# EAGLE design mcu_rev1 (EAGLE 9.5.0)

## Sheet 1 of 2
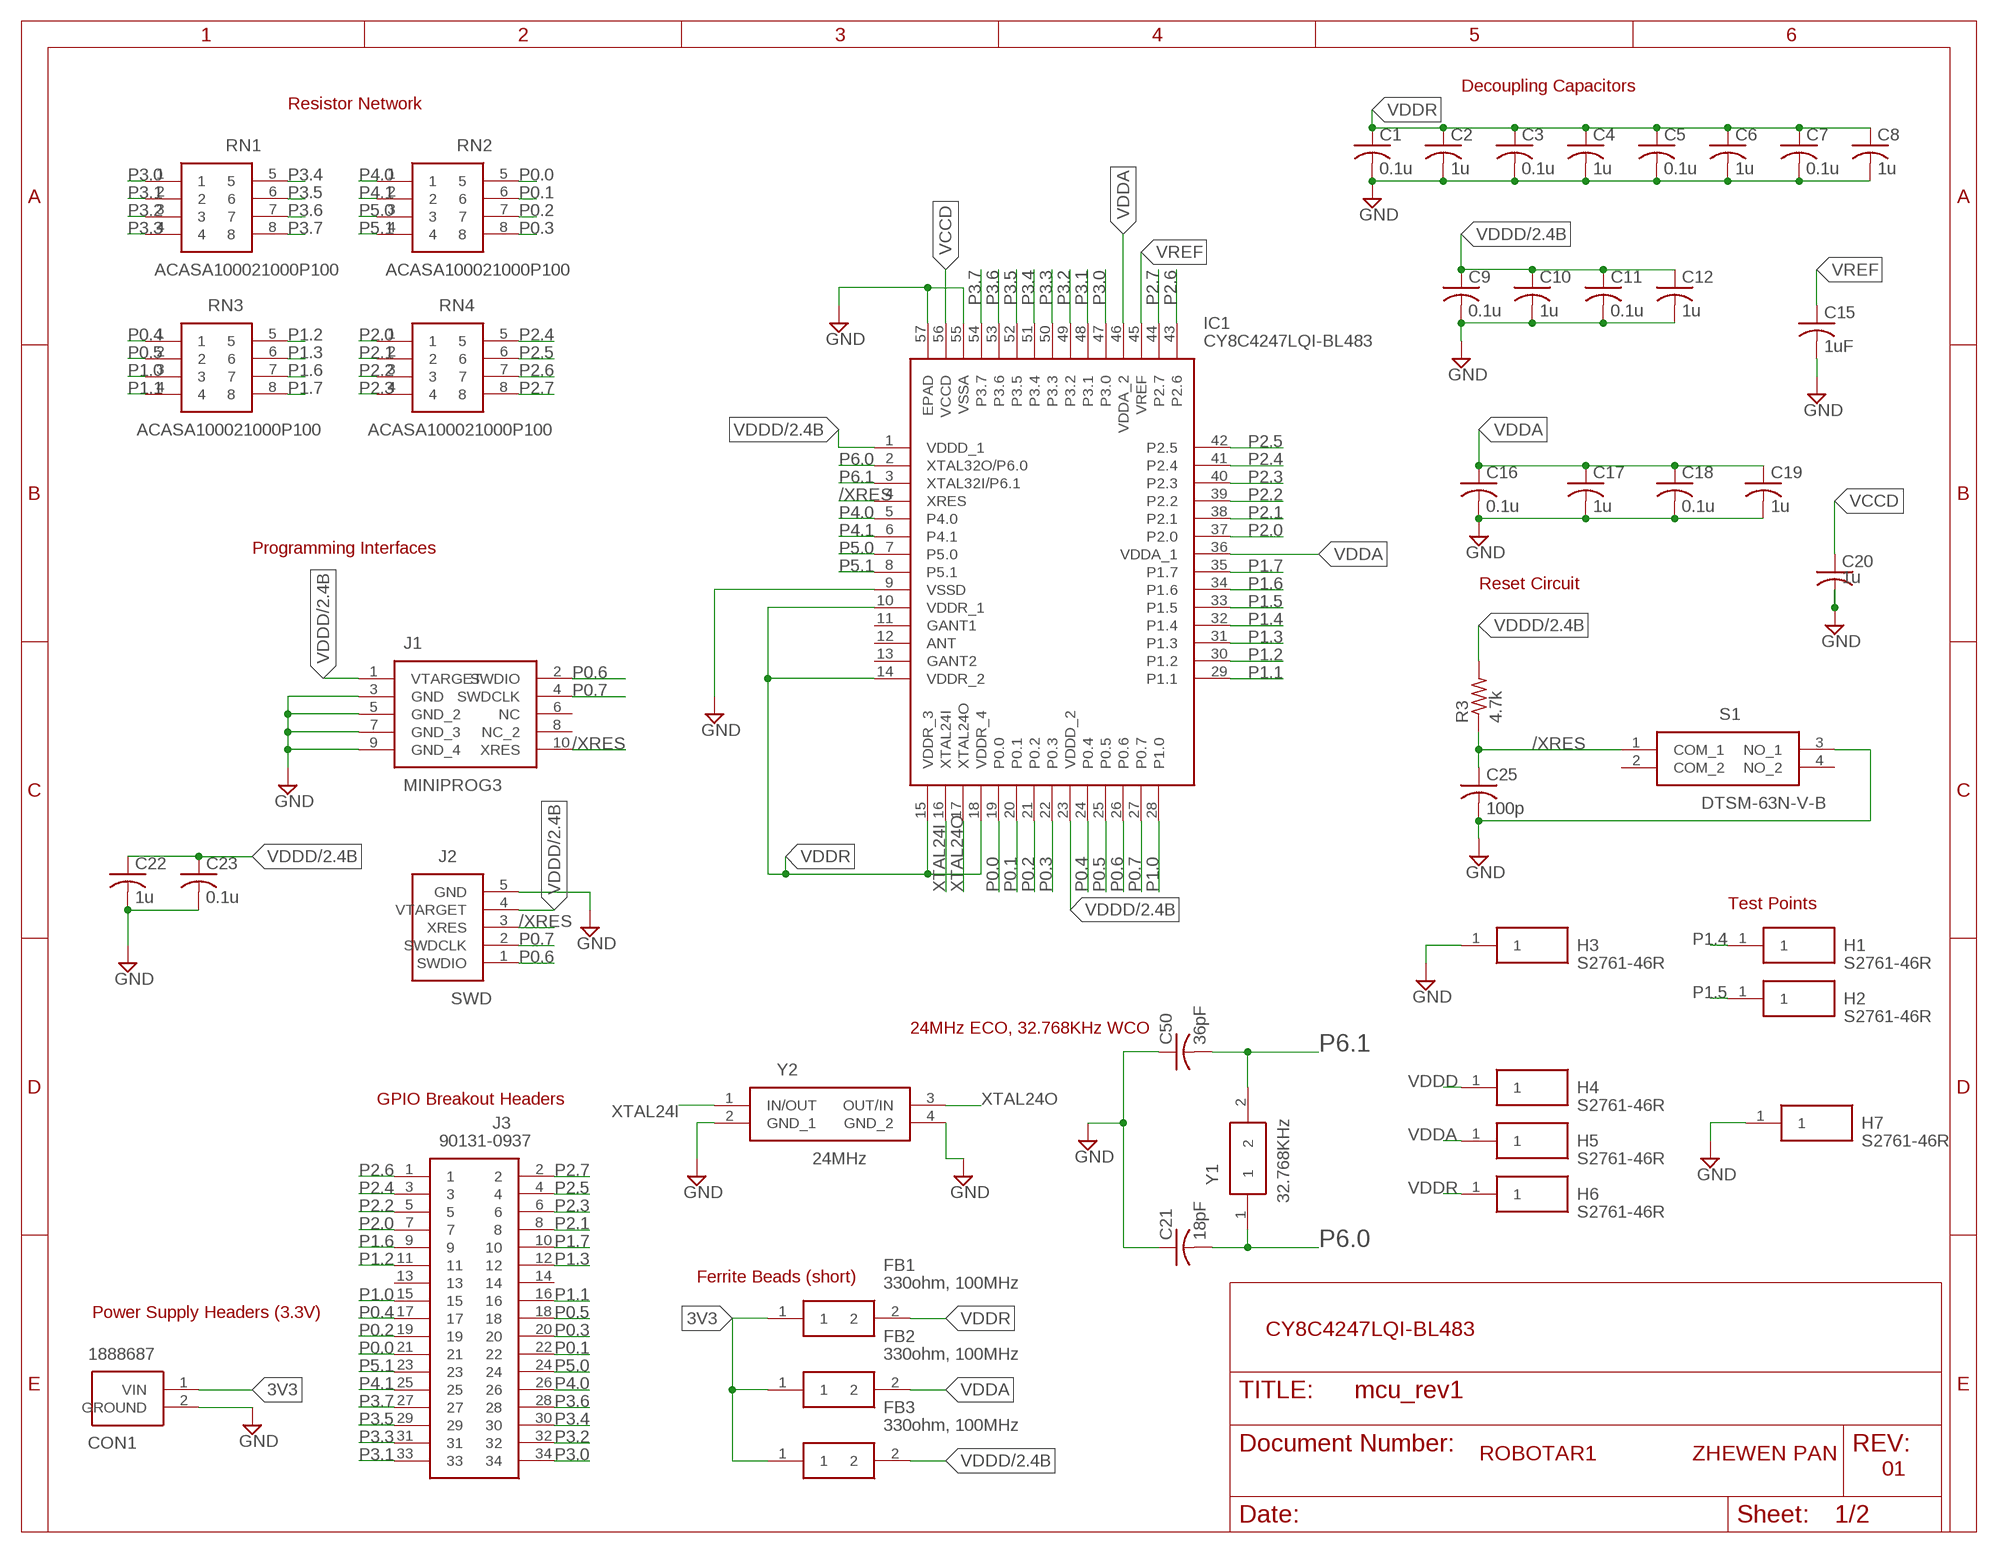
[diagram p0: schematic, sheet 1]

### Parts
C1  0.1u  C-USC0805  [C0805]
C2  1u  C-USC0805  [C0805]
C3  0.1u  C-USC0805  [C0805]
C4  1u  C-USC0805  [C0805]
C5  0.1u  C-USC0805  [C0805]
C6  1u  C-USC0805  [C0805]
C7  0.1u  C-USC0805  [C0805]
C8  1u  C-USC0805  [C0805]
C9  0.1u  C-USC0805  [C0805]
C10  1u  C-USC0805  [C0805]
C11  0.1u  C-USC0805  [C0805]
C12  1u  C-USC0805  [C0805]
C15  1uF  C-USC0805  [C0805]
C16  0.1u  C-USC0805  [C0805]
C17  1u  C-USC0805  [C0805]
C18  0.1u  C-USC0805  [C0805]
C19  1u  C-USC0805  [C0805]
C20  1u  C-USC0805  [C0805]
C21  18pF  C-USC0805  [C0805]
C22  1u  C-USC0805  [C0805]
C23  0.1u  C-USC0805  [C0805]
C25  100p  C-USC0805  [C0805]
C50  36pF  C-USC0805  [C0805]
CON1  1888687  [SHDR2W90P0X508_1X2_1016X950X15]
FB1  330ohm, 100MHz  BLM21PG331SN1D  [BEADC2012X105N]
FB2  330ohm, 100MHz  BLM21PG331SN1D  [BEADC2012X105N]
FB3  330ohm, 100MHz  BLM21PG331SN1D  [BEADC2012X105N]
H1  S2761-46R  [S276146R]
H2  S2761-46R  [S276146R]
H3  S2761-46R  [S276146R]
H4  S2761-46R  [S276146R]
H5  S2761-46R  [S276146R]
H6  S2761-46R  [S276146R]
H7  S2761-46R  [S276146R]
IC1  CY8C4247LQI-BL483  [QFN40P700X700X60-57N]
J1  MINIPROG3  FTSH-105-01-L-DV-K  [FTSH-105-01-L-DV-K]
J2  SWD  22-23-2051  [HDRV5W64P0X254_1X5_1255X635X81]
J3  90131-0937  [HDRV34W90P254_2X17_4308X500X56]
R3  4.7k  R-US_R0805  [R0805]
RN1  ACASA100021000P100  [ACASA100021000P100]
RN2  ACASA100021000P100  [ACASA100021000P100]
RN3  ACASA100021000P100  [ACASA100021000P100]
RN4  ACASA100021000P100  [ACASA100021000P100]
S1  DTSM-63N-V-B  [DTSM63NVB]
Y1  32.768KHz  ECS-.327-12.5-34B-TR  [ECX-31B]
Y2  24MHz  ECS-240-8-36CKM-TR  [ECS240836QAESTR]

### Nets
3V3: CON1.1(VIN) FB1.1 FB2.1 FB3.1
/XRES: C25.1 IC1.4(XRES) J1.10(XRES) J2.3(XRES) R3.1 S1.1(COM_1)
GND: C1.2 C2.2 C3.2 C4.2 C5.2 C6.2 C7.2 C8.2 C9.2 C10.2 C11.2 C12.2 C15.2 C16.2 C17.2 C18.2 C19.2 C20.2 C21.1 C22.2 C23.2 C25.2 C50.1 CON1.2(GROUND) H3.1 H7.1 IC1.9(VSSD) IC1.55(VSSA) IC1.57(EPAD) J1.3(GND) J1.5(GND_2) J1.7(GND_3) J1.9(GND_4) J2.5(GND) S1.3(NO_1) Y2.2(GND_1) Y2.4(GND_2) ; also sheet 2
P0.0: IC1.19(P0.0) J3.21 RN2.5
P0.1: IC1.20(P0.1) J3.22 RN2.6
P0.2: IC1.21(P0.2) J3.19 RN2.7
P0.3: IC1.22(P0.3) J3.20 RN2.8
P0.4: IC1.24(P0.4) J3.17 RN3.1
P0.5: IC1.25(P0.5) J3.18 RN3.2
P0.6: IC1.26(P0.6) J1.2(SWDIO) J2.1(SWDIO)
P0.7: IC1.27(P0.7) J1.4(SWDCLK) J2.2(SWDCLK)
P1.0: IC1.28(P1.0) J3.15 RN3.3
P1.1: IC1.29(P1.1) J3.16 RN3.4
P1.2: IC1.30(P1.2) J3.11 RN3.5
P1.3: IC1.31(P1.3) J3.12 RN3.6
P1.4: H1.1 IC1.32(P1.4) ; also sheet 2
P1.5: H2.1 IC1.33(P1.5) ; also sheet 2
P1.6: IC1.34(P1.6) J3.9 RN3.7 ; also sheet 2
P1.7: IC1.35(P1.7) J3.10 RN3.8
P2.0: IC1.37(P2.0) J3.7 RN4.1
P2.1: IC1.38(P2.1) J3.8 RN4.2
P2.2: IC1.39(P2.2) J3.5 RN4.3
P2.3: IC1.40(P2.3) J3.6 RN4.4
P2.4: IC1.41(P2.4) J3.3 RN4.5
P2.5: IC1.42(P2.5) J3.4 RN4.6
P2.6: IC1.43(P2.6) J3.1 RN4.7
P2.7: IC1.44(P2.7) J3.2 RN4.8
P3.0: IC1.47(P3.0) J3.34 RN1.1
P3.1: IC1.48(P3.1) J3.33 RN1.2
P3.2: IC1.49(P3.2) J3.32 RN1.3
P3.3: IC1.50(P3.3) J3.31 RN1.4
P3.4: IC1.51(P3.4) J3.30 RN1.5
P3.5: IC1.52(P3.5) J3.29 RN1.6
P3.6: IC1.53(P3.6) J3.28 RN1.7
P3.7: IC1.54(P3.7) J3.27 RN1.8
P4.0: IC1.5(P4.0) J3.26 RN2.1
P4.1: IC1.6(P4.1) J3.25 RN2.2
P5.0: IC1.7(P5.0) J3.24 RN2.3
P5.1: IC1.8(P5.1) J3.23 RN2.4
P6.0: C21.2 IC1.2(XTAL32O/P6.0) Y1.1
P6.1: C50.2 IC1.3(XTAL32I/P6.1) Y1.2
VCCD: C20.1 IC1.56(VCCD)
VDDA: C16.1 C17.1 C18.1 C19.1 FB2.2 H5.1 IC1.36(VDDA_1) IC1.46(VDDA_2)
VDDD: C9.1 C10.1 C11.1 C12.1 C22.1 C23.1 FB3.2 H4.1 IC1.1(VDDD_1) IC1.23(VDDD_2) J1.1(VTARGET) J2.4(VTARGET) R3.2 ; also sheet 2
VDDR: C1.1 C2.1 C3.1 C4.1 C5.1 C6.1 C7.1 C8.1 FB1.2 H6.1 IC1.10(VDDR_1) IC1.14(VDDR_2) IC1.15(VDDR_3) IC1.18(VDDR_4)
VREF: C15.1 IC1.45(VREF)
XTAL24I: IC1.16(XTAL24I) Y2.1(IN/OUT)
XTAL24O: IC1.17(XTAL24O) Y2.3(OUT/IN)
Unconnected: IC1.11(GANT1) IC1.12(ANT) IC1.13(GANT2) J1.6(NC) J1.8(NC_2) J3.13 J3.14 S1.2(COM_2) S1.4(NO_2)

### Notes on the sheet
- Decoupling Capacitors
- Resistor Network
- Programming Interfaces
- Reset Circuit
- Test Points
- 24MHz ECO, 32.768KHz WCO
- GPIO Breakout Headers
- Ferrite Beads (short)
- Power Supply Headers (3.3V)
- CY8C4247LQI-BL483
- ROBOTAR1 | ZHEWEN PAN | 01

## Sheet 2 of 2
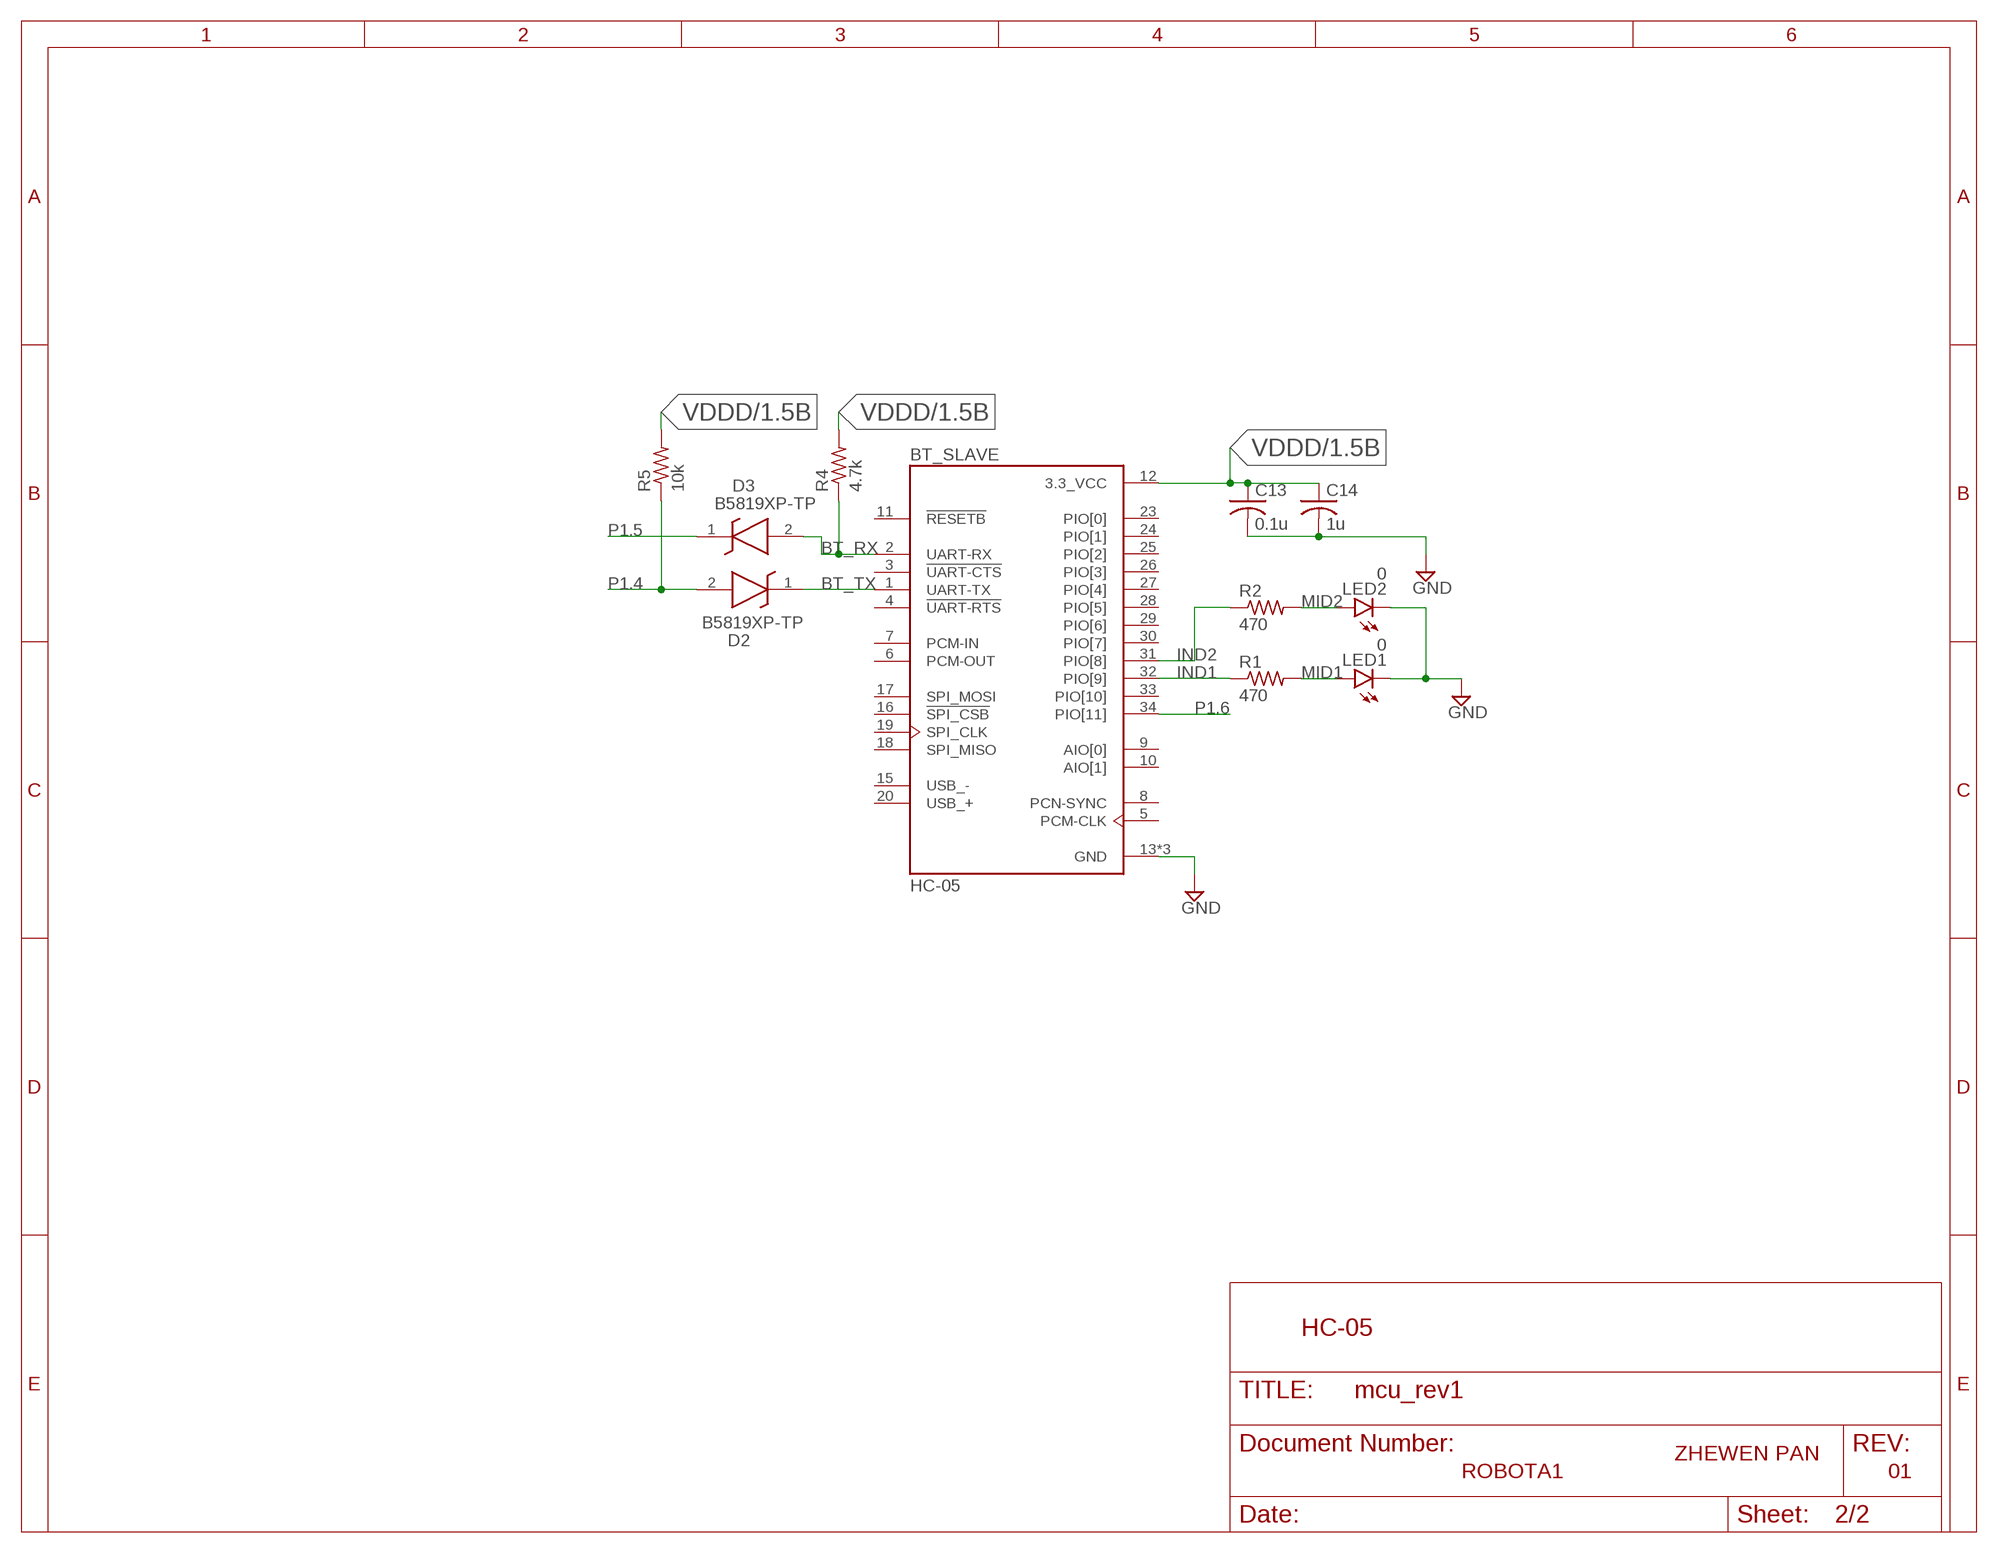
[diagram p1: schematic, sheet 2]

### Parts
BT_SLAVE  HC-05  [XCVR_HC-05]
C13  0.1u  C-USC0805  [C0805]
C14  1u  C-USC0805  [C0805]
D2  B5819XP-TP  [B5819XPTP]
D3  B5819XP-TP  [B5819XPTP]
LED1  0  LEDSML0805  [SML0805]
LED2  0  LEDSML0805  [SML0805]
R1  470  R-US_R0805  [R0805]
R2  470  R-US_R0805  [R0805]
R4  4.7k  R-US_R0805  [R0805]
R5  10k  R-US_R0805  [R0805]

### Nets
BT_RX: BT_SLAVE.2(UART-RX) D3.2(+) R4.1
BT_TX: BT_SLAVE.1(UART-TX) D2.1(-)
GND: BT_SLAVE.13(GND) BT_SLAVE.21(GND) BT_SLAVE.22(GND) C13.2 C14.2 LED1.C LED2.C ; also sheet 1
IND1: BT_SLAVE.32(PIO[9]) R1.1
IND2: BT_SLAVE.31(PIO[8]) R2.1
MID1: LED1.A R1.2
MID2: LED2.A R2.2
P1.4: D2.2(+) R5.1 ; also sheet 1
P1.5: D3.1(-) ; also sheet 1
P1.6: BT_SLAVE.34(PIO[11]) ; also sheet 1
VDDD: BT_SLAVE.12(3.3_VCC) C13.1 C14.1 R4.2 R5.2 ; also sheet 1
Unconnected: BT_SLAVE.3(!UART-CTS) BT_SLAVE.4(!UART-RTS) BT_SLAVE.5(PCM-CLK) BT_SLAVE.6(PCM-OUT) BT_SLAVE.7(PCM-IN) BT_SLAVE.8(PCN-SYNC) BT_SLAVE.9(AIO[0]) BT_SLAVE.10(AIO[1]) BT_SLAVE.11(!RESETB) BT_SLAVE.15(USB_-) BT_SLAVE.16(!SPI_CSB) BT_SLAVE.17(SPI_MOSI) BT_SLAVE.18(SPI_MISO) BT_SLAVE.19(SPI_CLK) BT_SLAVE.20(USB_+) BT_SLAVE.23(PIO[0]) BT_SLAVE.24(PIO[1]) BT_SLAVE.25(PIO[2]) BT_SLAVE.26(PIO[3]) BT_SLAVE.27(PIO[4]) BT_SLAVE.28(PIO[5]) BT_SLAVE.29(PIO[6]) BT_SLAVE.30(PIO[7]) BT_SLAVE.33(PIO[10])

### Notes on the sheet
- HC-05
- ZHEWEN PAN
- ROBOTA1 | 01

## Library data of the parts
BT_SLAVE = HC-05:HC-05: Bluetooth to Serial Port Module; AVAILABILITY: Unavailable; MF: Texas Instruments; MP: HC-05; PACKAGE: SOIC-14; PRICE: None; SPICEPREFIX: X
C1-C23 C25 C50 = rcl:C-US: CAPACITOR, American symbol; SPICEPREFIX: C
CON1 = SamacSys_Parts:1888687: Phoenix Contact COMBICON MKDSN Series 5.08mm Pitch Straight PCB Terminal Block with Screw Termination, Through Hole Source: Datasheet <http://uk.rs-online.com/web/p/products/8045095>; ALLIED_NUMBER: 70054422; DESCRIPTION: Phoenix Contact COMBICON MKDSN Series 5.08mm Pitch Straight PCB Terminal Block with Screw Termination, Through Hole; HEIGHT: 15mm; MANUFACTURER_NAME: Phoenix Contact; MANUFACTURER_PART_NUMBER: 1888687; RS_PART_NUMBER: 8045095; RS_PRICE-STOCK: http://uk.rs-online.com/web/p/products/8045095
D2 D3 = SamacSys_Parts:B5819XP-TP: Schottky Diodes & Rectifiers 1A,40V,Schottky,FBP-02L Package Source: Datasheet <http://www.mccsemi.com/up_pdf/B5819XP(FBP-02L)-B.pdf>; DESCRIPTION: Schottky Diodes & Rectifiers 1A,40V,Schottky,FBP-02L Package; HEIGHT: 0.55mm; MANUFACTURER_NAME: Micro Commercial Components (MCC); MANUFACTURER_PART_NUMBER: B5819XP-TP
FB1-FB3 = BLM21PG331SN1D:BLM21PG331SN1D: Ferrite bead 0805 SMD 330R 1.5A Ferrite bead 0805 SMD 330R 1.5A Source: Datasheet <http://uk.rs-online.com/web/p/products/7241545P>; DESCRIPTION: Ferrite bead 0805 SMD 330R 1.5A Ferrite bead 0805 SMD 330R 1.5A; HEIGHT: 1.05mm; MANUFACTURER_NAME: Murata Electronics; MANUFACTURER_PART_NUMBER: BLM21PG331SN1D; RS_PART_NUMBER: 7241545P; RS_PRICE-STOCK: http://uk.rs-online.com/web/p/products/7241545P
H1-H7 = S2761-46R:S2761-46R: Circuit Board Hardware - PCB SMT Mini Test Terminal, Reel Source: Datasheet <https://cdn.harwin.com/pdfs/S2761R.pdf>; DESCRIPTION: Circuit Board Hardware - PCB SMT Mini Test Terminal, Reel; HEIGHT: 1.15mm; MANUFACTURER_NAME: HARWIN; MANUFACTURER_PART_NUMBER: S2761-46R
IC1 = cy_mcu:CY8C4247LQI-BL483: CYPRESS SEMICONDUCTOR - CY8C4247LQI-BL483 - MCU, 32BIT, CORTEX-M0, 48MHZ, QFN-56 Source: Datasheet <http://uk.rs-online.com/web/p/products/1242964P>; DESCRIPTION: CYPRESS SEMICONDUCTOR - CY8C4247LQI-BL483 - MCU, 32BIT, CORTEX-M0, 48MHZ, QFN-56; HEIGHT: 0.6mm; MANUFACTURER_NAME: Cypress Semiconductor; MANUFACTURER_PART_NUMBER: CY8C4247LQI-BL483; RS_PART_NUMBER: 1242964P; RS_PRICE-STOCK: http://uk.rs-online.com/web/p/products/1242964P
J1 = SamacSys_Parts:FTSH-105-01-L-DV-K: SMT Micro Header, 10 position, 2-row Source: Datasheet <http://suddendocs.samtec.com/catalog_english/ftsh_smt.pdf>; DESCRIPTION: SMT Micro Header, 10 position, 2-row; HEIGHT: mm; MANUFACTURER_NAME: SAMTEC; MANUFACTURER_PART_NUMBER: FTSH-105-01-L-DV-K; RS_PART_NUMBER: 1592332; RS_PRICE-STOCK: https://uk.rs-online.com/web/p/products/1592332
J2 = SamacSys_Parts:22-23-2051: Headers & Wire Housings VERT PCB HDR 5P TIN FRICTION LOCK Source: Datasheet <http://uk.rs-online.com/web/p/products/1888757>; ALLIED_NUMBER: 70190811; DESCRIPTION: Headers & Wire Housings VERT PCB HDR 5P TIN FRICTION LOCK; HEIGHT: 8.18mm; MANUFACTURER_NAME: Molex; MANUFACTURER_PART_NUMBER: 22-23-2051; RS_PART_NUMBER: 1888757; RS_PRICE-STOCK: http://uk.rs-online.com/web/p/products/1888757
J3 = 90131-0937:90131-0937: Molex C-GRID III Series, Series Number 90131, 2.54mm Pitch 34 Way 2 Row Straight PCB Header, Solder Termination, 3A Source: Datasheet <http://uk.rs-online.com/web/p/products/6703569>; ALLIED_NUMBER: 70373750; DESCRIPTION: Molex C-GRID III Series, Series Number 90131, 2.54mm Pitch 34 Way 2 Row Straight PCB Header, Solder Termination, 3A; HEIGHT: 5.6mm; MANUFACTURER_NAME: Molex; MANUFACTURER_PART_NUMBER: 90131-0937; RS_PART_NUMBER: 6703569; RS_PRICE-STOCK: http://uk.rs-online.com/web/p/products/6703569
LED1 LED2 = led:LED: LED OSRAM: - CHIPLED LG R971, LG N971, LY N971, LG Q971, LY Q971, LO R971, LY R971 LH N974, LH R974 LS Q976, LO Q976, LY Q976 LO Q996 - Hyper CHIPLED LW Q18S LB Q993, LB Q99A, LB R99A - SideLED LS A670, LO A670, LY A670, LG A670, LP A670 LB A673, LV A673, LT A673, LW A673 LH A674 LY A675 LS A676, LA A676, LO A676, LY A676, LW A676 LS A679, LY A679, LG A679 - Hyper Micro SIDELED® LS Y876, LA Y876, LO Y876, LY Y876 LT Y87S - SmartLED LW L88C, LW L88S LB L89C, LB L89S, LG L890 LS L89K, LO L89K, LY L89K LS L896, LA L896, LO L896, LY L896 - TOPLED LS T670, LO T670, LY T670, LG T670, LP T670 LSG T670, LSP T670, LSY T670, LOP T670, LYG T670 LG T671, LOG T671, LSG T671 LB T673, LV T673, LT T673, LW T673 LH T674 LS T676, LA T676, LO T676, LY T676, LB T676, LH T676, LSB T676, LW T676 LB T67C, LV T67C, LT T67C, LS T67K, LO T67K, LY T67K, LW E67C LS E67B, LA E67B, LO E67B, LY E67B, LB E67C, LV E67C, LT E67C LW T67C LS T679, LY T679, LG T679 LS T770, LO T770, LY T770, LG T770, LP T770 LB T773, LV T773, LT T773, LW T773 LH T774 LS E675, LA E675, LY E675, LS T675 LS T776, LA T776, LO T776, LY T776, LB T776 LHGB T686 LT T68C, LB T68C - Hyper Mini TOPLED® LB M676 - Mini TOPLED Santana® LG M470 LS M47K, LO M47K, LY M47K Source: http://www.osram.convergy.de LUXEON: - LUMILED® LXK2-PW12-R00, LXK2-PW12-S00, LXK2-PW14-U00, LXK2-PW14-V00 LXK2-PM12-R00, LXK2-PM12-S00, LXK2-PM14-U00 LXK2-PE12-Q00, LXK2-PE12-R00, LXK2-PE12-S00, LXK2-PE14-T00, LXK2-PE14-U00 LXK2-PB12-K00, LXK2-PB12-L00, LXK2-PB12-M00, LXK2-PB14-N00, LXK2-PB14-P00, LXK2-PB14-Q00 LXK2-PR12-L00, LXK2-PR12-M00, LXK2-PR14-Q00, LXK2-PR14-R00 LXK2-PD12-Q00, LXK2-PD12-R00, LXK2-PD12-S00 LXK2-PH12-R00, LXK2-PH12-S00 LXK2-PL12-P00, LXK2-PL12-Q00, LXK2-PL12-R00 Source: www.luxeon.com KINGBRIGHT: KA-3528ASYC Source: www.kingbright.com
R1-R5 = rcl:R-US_: RESISTOR, American symbol; SPICEPREFIX: R
RN1-RN4 = ACASA100021000P100:ACASA100021000P100: Vishay ACAS 0612 - Professional Series 100 +/-0.5% Isolated SMT Resistor Array, 4 Resistors, 0.3W total Source: Datasheet <http://uk.rs-online.com/web/p/products/6845742P>; ALLIED_NUMBER: 70398241; DESCRIPTION: Vishay ACAS 0612 - Professional Series 100 +/-0.5% Isolated SMT Resistor Array, 4 Resistors, 0.3W total; HEIGHT: 0mm; MANUFACTURER_NAME: Vishay; MANUFACTURER_PART_NUMBER: ACASA100021000P100; RS_PART_NUMBER: 6845742P; RS_PRICE-STOCK: http://uk.rs-online.com/web/p/products/6845742P
S1 = push_button:DTSM-63N-V-B: Tactile Switches Surface Mounting Type 6*6 Source: Datasheet <http://www.dip.com.tw/en/en-product-information/en-switch004/item/download/2502_92b64433b455dc19d9198989b26071be>; DESCRIPTION: Tactile Switches Surface Mounting Type 6*6; HEIGHT: 7.1mm; MANUFACTURER_NAME: Diptronics; MANUFACTURER_PART_NUMBER: DTSM-63N-V-B
Y1 = SamacSys_Parts:ECS-.327-12.5-34B-TR: Crystals 32.768KHz 20ppm 12.5pF -40C +85C Source: Datasheet; DESCRIPTION: Crystals 32.768KHz 20ppm 12.5pF -40C +85C; HEIGHT: mm; MANUFACTURER_NAME: ECS; MANUFACTURER_PART_NUMBER: ECS-.327-12.5-34B-TR
Y2 = SamacSys_Parts:ECS-240-8-36CKM-TR: Crystals 24MHz 10ppm Source: Datasheet; DESCRIPTION: Crystals 24MHz 10ppm; HEIGHT: 0mm; MANUFACTURER_NAME: ECS; MANUFACTURER_PART_NUMBER: ECS-240-8-36CKM-TR; SPICEPREFIX: E

## Board
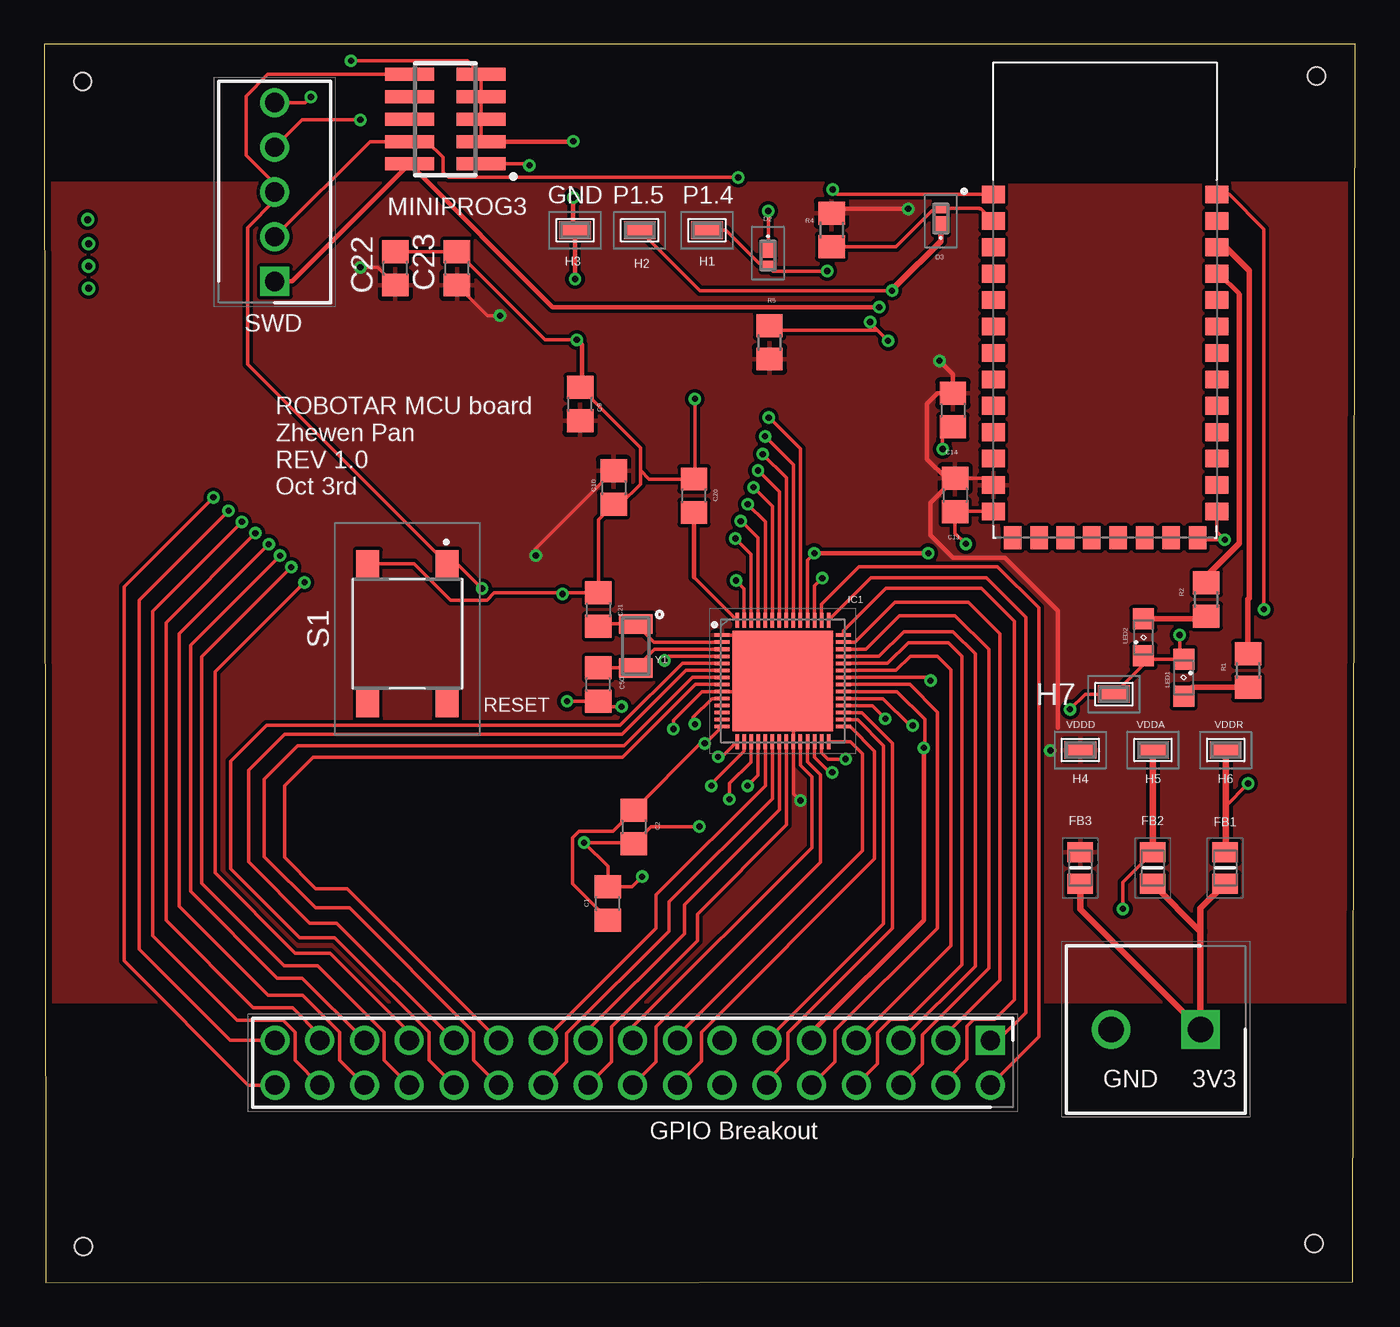
[diagram p2: board, top side]
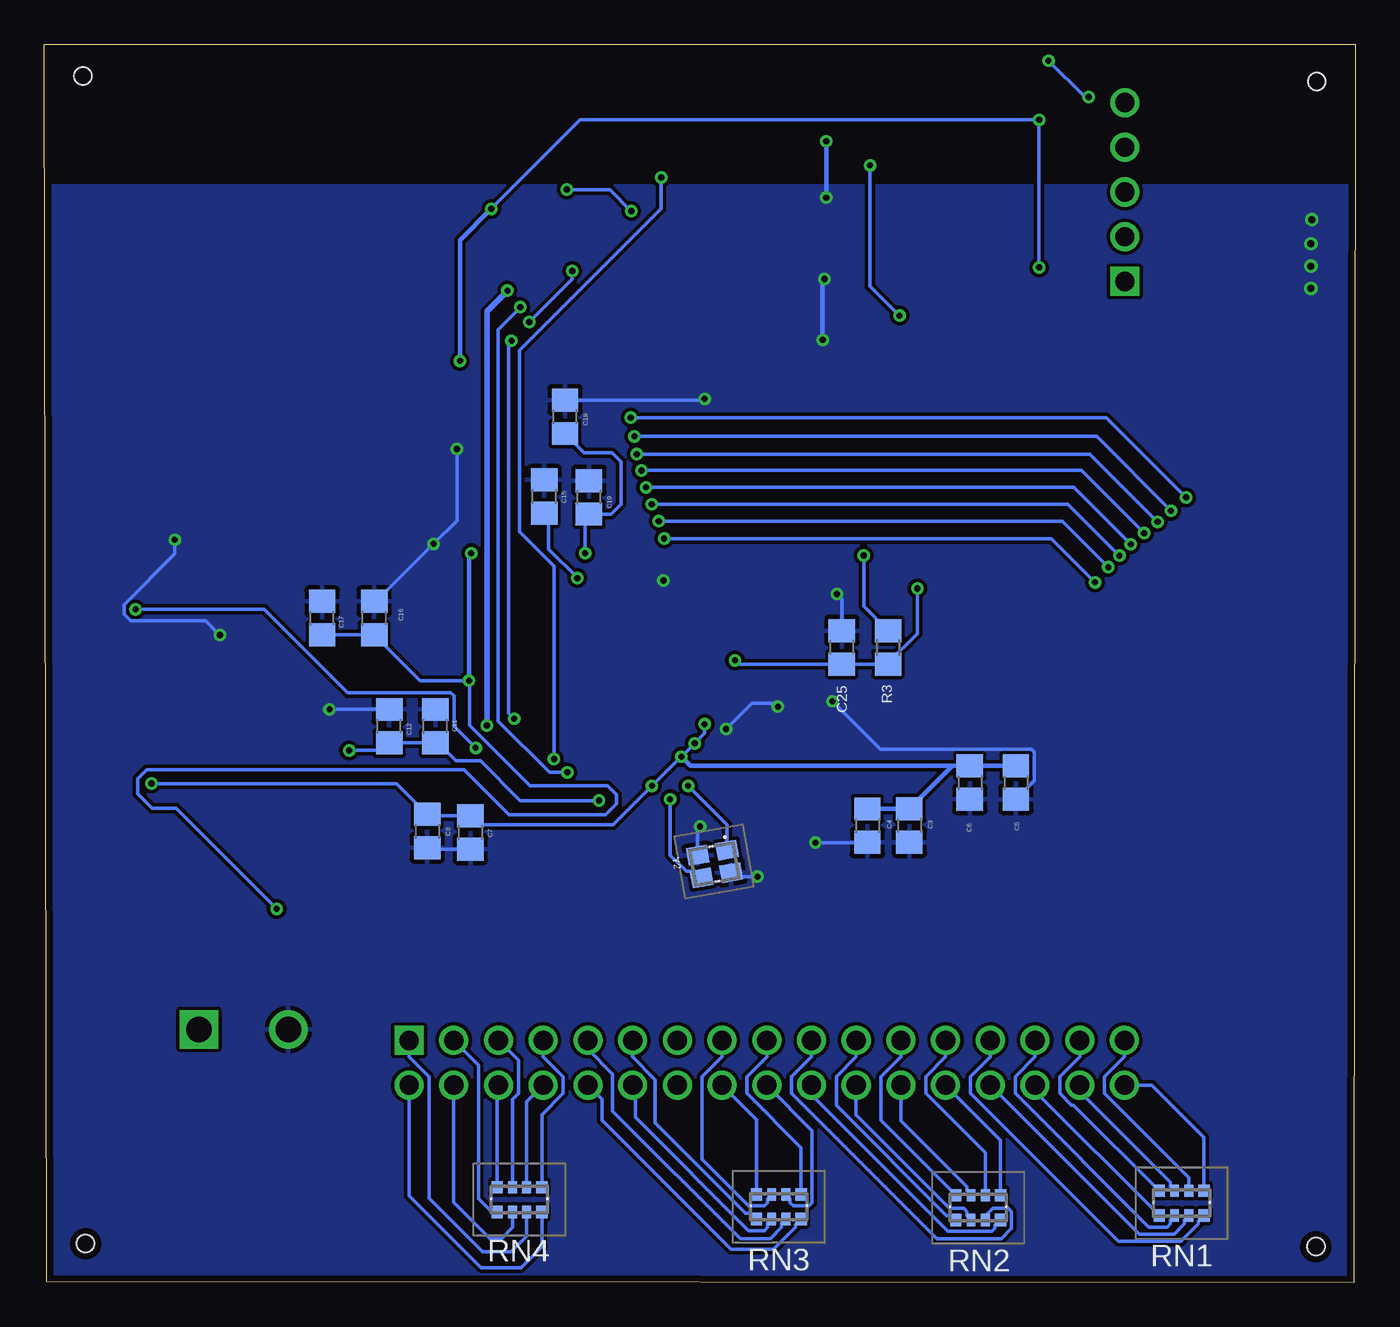
[diagram p3: board, bottom side, seen from below]

Size 74.5 x 70.34 mm. Coordinates in mm from the lower left corner, seen from the top.
Outline: 0.1,0 74.35,0.05 74.5,70.34 0,70.34 0.1,0
Copper layers (1*16): Top 0.0356mm / dielectric 1.5011mm / Bottom 0.0356mm
Design rules "ECE_Senior_Design": minimum track width 8mil, minimum drill 13mil, track to track 8mil, track to pad 8mil, pad to pad 6mil, via to via 8mil, smd to smd 6mil, copper to edge 15mil, drill to drill 8mil, minimum pad ring 7mil, minimum via ring 7mil, stop-mask expansion 3mil, vias tented up to drill 0mil, thermal gap 10mil
Holes 1 mm at 2.2,68.22 72.29,68.52 72.14,2.23 2.24,2.06

### Footprints (pad centres in the part's own frame; a part is rotated, then mirrored left to right if it is on the bottom)
XCVR_HC-05 = smd 1.3 x 1: 1 -6.35,6.325; 2 -6.35,4.825; 3 -6.35,3.325; 4 -6.35,1.825; 5 -6.35,0.325; 6 -6.35,-1.175; 7 -6.35,-2.675; 8 -6.35,-4.175; 9 -6.35,-5.675; 10 -6.35,-7.175; 11 -6.35,-8.675; 12 -6.35,-10.175; 13 -6.35,-11.675; 22 6.35,-11.675; 23 6.35,-10.175; 24 6.35,-8.675; 25 6.35,-7.175; 26 6.35,-5.675; 27 6.35,-4.175; 28 6.35,-2.675; 29 6.35,-1.175; 30 6.35,0.325; 31 6.35,1.825; 32 6.35,3.325; 33 6.35,4.825; 34 6.35,6.325 | smd 1 x 1.3: 14 -5.25,-13.175; 15 -3.75,-13.175; 16 -2.25,-13.175; 17 -0.75,-13.175; 18 0.75,-13.175; 19 2.25,-13.175; 20 3.75,-13.175; 21 5.25,-13.175
C0805 = smd 1.3 x 1.5: 1 -0.95,0; 2 0.95,0
SHDR2W90P0X508_1X2_1016X950X15 = drill 1.45 pad 2.175 square: 1 0,0 | drill 1.45 pad 2.175: 2 5.08,0
B5819XPTP = smd 1 x 0.76: 1 -0.365,0 | smd 0.56 x 0.7: 2 0.585,0
BEADC2012X105N = smd 1.15 x 1.45: 1 -0.9,0; 2 0.9,0
S276146R = smd 1.8 x 1: 1 0,0
QFN40P700X700X60-57N = smd 0.85 x 0.2: 1 -3.45,2.6; 2 -3.45,2.2; 3 -3.45,1.8; 4 -3.45,1.4; 5 -3.45,1; 6 -3.45,0.6; 7 -3.45,0.2; 8 -3.45,-0.2; 9 -3.45,-0.6; 10 -3.45,-1; 11 -3.45,-1.4; 12 -3.45,-1.8; 13 -3.45,-2.2; 14 -3.45,-2.6; 29 3.45,-2.6; 30 3.45,-2.2; 31 3.45,-1.8; 32 3.45,-1.4; 33 3.45,-1; 34 3.45,-0.6; 35 3.45,-0.2; 36 3.45,0.2; 37 3.45,0.6; 38 3.45,1; 39 3.45,1.4; 40 3.45,1.8; 41 3.45,2.2; 42 3.45,2.6 | smd 0.2 x 0.85: 15 -2.6,-3.45; 16 -2.2,-3.45; 17 -1.8,-3.45; 18 -1.4,-3.45; 19 -1,-3.45; 20 -0.6,-3.45; 21 -0.2,-3.45; 22 0.2,-3.45; 23 0.6,-3.45; 24 1,-3.45; 25 1.4,-3.45; 26 1.8,-3.45; 27 2.2,-3.45; 28 2.6,-3.45; 43 2.6,3.45; 44 2.2,3.45; 45 1.8,3.45; 46 1.4,3.45; 47 1,3.45; 48 0.6,3.45; 49 0.2,3.45; 50 -0.2,3.45; 51 -0.6,3.45; 52 -1,3.45; 53 -1.4,3.45; 54 -1.8,3.45; 55 -2.2,3.45; 56 -2.6,3.45 | smd 5.7 x 5.7: 57 0,0
FTSH-105-01-L-DV-K = smd 0.74 x 2.79: 1 -2.54,-2.035; 2 -2.54,2.035; 3 -1.27,-2.035; 4 -1.27,2.035; 5 0,-2.035; 6 0,2.035; 7 1.27,-2.035; 8 1.27,2.035; 9 2.54,-2.035; 10 2.54,2.035
HDRV5W64P0X254_1X5_1255X635X81 = drill 1.1 pad 1.65 square: 1 0,0 | drill 1.1 pad 1.65: 2 2.54,0; 3 5.08,0; 4 7.62,0; 5 10.16,0
HDRV34W90P254_2X17_4308X500X56 = drill 1.1 pad 1.65 square: 1 0,0 | drill 1.1 pad 1.65: 2 0,2.54; 3 2.54,0; 4 2.54,2.54; 5 5.08,0; 6 5.08,2.54; 7 7.62,0; 8 7.62,2.54; 9 10.16,0; 10 10.16,2.54; 11 12.7,0; 12 12.7,2.54; 13 15.24,0; 14 15.24,2.54; 15 17.78,0; 16 17.78,2.54; 17 20.32,0; 18 20.32,2.54; 19 22.86,0; 20 22.86,2.54; 21 25.4,0; 22 25.4,2.54; 23 27.94,0; 24 27.94,2.54; 25 30.48,0; 26 30.48,2.54; 27 33.02,0; 28 33.02,2.54; 29 35.56,0; 30 35.56,2.54; 31 38.1,0; 32 38.1,2.54; 33 40.64,0; 34 40.64,2.54
SML0805 = smd 1.2 x 1.2: A 1.05,0; C -1.05,0
R0805 = smd 1.3 x 1.5: 1 -0.95,0; 2 0.95,0
ACASA100021000P100 = smd 0.64 x 0.7: 1 -1.27,-0.7; 4 1.27,-0.7; 5 1.27,0.7; 8 -1.27,0.7 | smd 0.5 x 0.7: 2 -0.4,-0.7; 3 0.4,-0.7; 6 0.4,0.7; 7 -0.4,0.7
DTSM63NVB = smd 1.55 x 1.3: 1 -3.975,2.25; 2 3.975,2.25; 3 -3.975,-2.25; 4 3.975,-2.25
ECX-31B = smd 1.1 x 1.9: 1 -1.25,0; 2 1.25,0
ECS240836QAESTR = smd 1.2 x 1: 1 -0.85,-0.65; 2 0.85,-0.65; 3 0.85,0.65; 4 -0.85,0.65

### Placement (x,y rotation side)
BT_SLAVE  60.27,55.47 0 top
C1  32.03,21.53 90 top
C2  33.51,25.89 270 top
C3  25.35,25.97 270 bottom
C4  27.72,25.95 270 bottom
C5  19.29,28.4 270 bottom
C6  21.91,28.4 270 bottom
C7  50.28,25.57 270 bottom
C8  52.73,25.65 270 bottom
C9  30.45,49.89 90 top
C10  32.36,45.15 270 top
C11  52.27,31.61 90 bottom
C12  54.89,31.61 90 bottom
C13  51.76,44.73 270 top
C14  51.63,49.56 270 top
C15  46.09,44.65 90 bottom
C16  55.74,37.74 90 bottom
C17  58.7,37.74 90 bottom
C18  44.9,49.17 90 bottom
C19  43.55,44.6 90 bottom
C20  36.92,44.69 90 top
C21  31.49,38.23 270 top
C22  19.96,57.61 90 top
C23  23.46,57.61 90 top
C25  29.18,36.08 90 bottom
C50  31.49,33.97 90 top
CON1  65.7,14.39 180 top
D2  41.12,58.33 270 top
D3  50.94,60.43 90 top
FB1  67.09,23.55 90 top
FB2  62.98,23.55 90 top
FB3  58.87,23.55 90 top
H1  37.66,59.77 0 top
H2  33.84,59.77 0 top
H3  30.17,59.77 0 top
H4  58.87,30.25 0 top
H5  63,30.25 0 top
H6  67.12,30.25 0 top
H7  60.77,33.43 0 top
IC1  41.97,34.17 0 top
J1  22.79,66.08 90 top
J2  13.11,56.86 90 top
J3  53.76,13.76 180 top
LED1  64.74,34.36 270 top
LED2  62.45,36.65 90 top
R1  68.39,34.76 270 top
R2  66.02,38.8 270 top
R3  26.55,36.08 90 bottom
R4  44.74,59.79 90 top
R5  41.21,53.41 270 top
RN1  9.87,4.52 180 bottom
RN2  21.43,4.27 180 bottom
RN3  32.76,4.32 180 bottom
RN4  47.49,4.72 180 bottom
S1  20.64,36.86 270 top
Y1  33.63,36.16 270 top
Y2  36.42,23.78 190 bottom

### Tracks (layer width: path | path; a pad name or v marks a point on that pad's centre or on a via)
3V3
  Top 0.381: CON1.1 65.7,21.26 FB1.1 | CON1.1 65.7,19.94 FB2.1 | CON1.1 58.87,21.22 FB3.1
/XRES  (via drill 0.35)
  Top 0.203: J1.10 12.72,68.62 11.49,67.39 11.49,64.03 13.11,62.42 J2.3 13.11,61.46 11.57,59.92 11.57,52.15 S1.1 23.47,40.83 v24.88,39.42 | IC1.4 35.48,35.57 v35.25,35.34
  Bottom 0.203: v35.25,35.34 35.04,35.13 C25.1 R3.1 26.55,35.2 24.89,36.87 v24.89,39.42 v24.88,39.42
BT_RX
  Top 0.203: BT_SLAVE.2 53.22,60.99 53.14,60.99 53.12,61.02 D3.2 50.8,60.87 50.43,60.87 48.4,58.84 R4.1
BT_TX  (via drill 0.35)
  Top 0.203: BT_SLAVE.1 45.08,61.8 v44.8,62.08 | v41.14,60.86 41.14,58.71 D2.1
  Bottom 0.203: v44.8,62.08 42.36,62.08 v41.14,60.86
GND  (via drill 0.35, 0.4)
  Top 0.203: J1.3 J1.5 J1.7 J1.9 24.05,69.39 v17.44,69.39 | 33.87,46.13 33.87,45.35 32.73,44.2 C10.2 31.49,43.33 C21.1 29.52,39.18 | 33.87,46.13 33.87,47.42 30.56,50.74 C9.2 | 30.17,59.87 H3.1 | v15.16,67.34 14.84,67.02 J2.5 | 29.52,39.18 v29.46,39.12 | v52.37,41.96 51.76,42.57 C13.2 51.78,43.8 BT_SLAVE.13 | 33.87,46.13 34.36,45.64 C20.2 37.03,45.64 36.97,45.69 v36.97,50.19 | v58.28,32.56 59.15,33.43 H7.1 62.45,35.1 LED2.C 62.64,35.41 LED1.C 64.51,35.64 v64.51,36.78 | BT_SLAVE.21 65.63,42.19 v67.07,42.19 66.62,42.64 BT_SLAVE.22 | S1.3 21.04,40.83 23.1,38.76 25.16,38.76 25.57,39.18 29.52,39.18 | v29.71,33.02 C50.1 31.8,32.72 v32.81,32.72 | v35.76,31.45 35.76,31.95 37.38,33.57 IC1.9 41.37,33.57 IC1.57 | C14.2 51.05,48.02 v51.05,47.35 | v33.98,23.06 33.4,22.48 C1.2 32.03,23.64 v30.68,24.99 33.46,24.99 C2.2 34.48,25.91 v37.23,25.91 | v39.31,39.88 39.77,39.42 IC1.55 | v30.27,53.54 28.48,53.54 C23.2 C22.2
  Top 0.254: J1.3 30.05,64.81 v30.07,64.82 | v30.07,61.62 30.07,59.97 30.17,59.87 | H3.1 v30.17,57 | v30.27,53.54 30.56,53.25 30.56,50.74
  Bottom 0.203: C7.2 52.65,24.62 C8.2 | v15.16,67.34 15.38,67.34 v17.44,69.39 | C16.2 55.63,38.69 v52.37,41.96 51.05,43.28 v51.05,47.35 | C18.2 37.04,50.12 v36.97,50.19 | C12.2 v58.28,32.56 | v64.51,36.78 65.31,37.59 69.57,37.59 69.95,37.97 69.95,38.52 67.07,41.4 v67.07,42.19 | v29.71,33.02 27,30.31 18.41,30.31 18.23,30.13 18.23,28.51 C5.2 | v35.76,31.45 34.28,32.92 33.01,32.92 v32.81,32.72 | C4.2 27.73,24.99 v30.68,24.99 | v33.98,23.06 35.24,23.06 Y2.4 | v37.23,25.91 37.37,25.77 Y2.2 | C25.2 29.18,38.84 v29.46,39.12
  Bottom 0.254: v30.07,64.82 v30.07,61.62 | v30.17,57 30.27,56.9 v30.27,53.54
  other vias: 2.48,60.38 2.53,59 2.53,57.73 2.53,56.46
  pour Bottom: -2.14,-0.66 76.19,-0.66 76.24,-0.71 76.24,62.13 76.04,62.33 -2.14,62.33
IND1
  Top 0.305: R1.1 68.39,38.81 68.46,38.88 68.46,57.46 67.13,58.8 BT_SLAVE.32
IND2
  Top 0.254: 67.89,56.11 67.89,56.15 66.74,57.3 BT_SLAVE.31
  Top 0.305: R2.1 66.02,40.13 67.89,42 67.89,56.11
MID1
  Top 0.305: LED1.A 65.24,33.81 R1.2
MID2
  Top 0.305: R2.2 65.86,37.7 LED2.A
P0.0
  Top 0.203: J3.21 28.42,13.76 34.77,20.12 34.77,22.03 40.97,28.23 IC1.19
  Bottom 0.203: RN2.5 22.95,3.82 23.22,3.82 29.49,10.08 29.49,11.69 28.36,12.82 J3.21
P0.1
  Top 0.203: J3.22 29.7,12.55 29.7,14.16 35.51,19.97 35.51,21.62 41.37,27.48 IC1.20
  Bottom 0.203: RN2.6 22.08,3.81 22.08,4.04 22.25,4.22 23.06,4.22 28.36,9.53 J3.22
P0.2
  Top 0.203: J3.19 30.9,14.36 36.37,19.83 36.37,21.47 41.77,26.87 IC1.21
  Bottom 0.203: RN2.7 20.88,3.72 20.88,3.95 20.61,4.22 19.71,4.22 19.54,4.04 19.54,3.09 20.12,2.51 23.78,2.51 32.03,10.76 32.03,11.69 30.9,12.82 J3.19
P0.3
  Top 0.203: J3.20 32.24,12.55 32.24,14.55 37.11,19.42 37.11,20.94 42.17,26 IC1.22
  Bottom 0.203: J3.20 30.9,10.67 23.15,2.91 20.65,2.91 20.48,3.09 20.48,3.25 RN2.8
P0.4
  Top 0.203: J3.17 33.44,14.53 43.63,24.71 43.63,28.73 42.97,29.39 IC1.24
  Bottom 0.203: RN3.1 31.49,7.67 34.57,10.76 34.57,11.69 33.44,12.82 J3.17
P0.5
  Top 0.203: J3.18 34.78,12.55 34.78,14.54 44.11,23.87 44.11,28.86 43.37,29.6 IC1.25
  Bottom 0.203: J3.18 30.86,8.64 30.86,4.54 31.04,4.36 31.93,4.36 32.11,4.54 32.11,4.77 RN3.2
P0.6  (via drill 0.35)
  Top 0.203: IC1.26 43.77,29.83 44.62,28.98 v44.77,28.98
  Top 0.254: v47.44,55.4 28.9,55.4 J1.2 14.08,56.86 J2.1
  Bottom 0.203: v44.77,28.98 45.79,28.98 48.71,31.89 48.71,52.6 48.71,54.13 v47.44,55.4
P0.7  (via drill 0.35)
  Top 0.203: J2.2 18.51,64.81 J1.4 21.78,64.81 22.68,63.9 22.68,63.06 22.98,62.76 v39.44,62.76 | v45.53,29.74 44.52,29.74 44.17,30.09 IC1.27
  Bottom 0.203: v45.53,29.74 45.53,40.7 47.47,42.64 47.47,52.95 39.44,60.99 v39.44,62.76
P1.0
  Top 0.203: J3.15 35.98,14.02 46.5,24.53 46.5,30.05 45.82,30.72 IC1.28
  Bottom 0.203: J3.15 35.98,12.82 37.11,11.69 37.11,7 34.47,4.36 33.58,4.36 33.4,4.54 33.4,4.77 RN3.3
P1.1
  Top 0.203: IC1.29 45.8,31.57 47.19,30.19 47.19,24.08 37.34,14.23 37.34,12.58 J3.16
  Bottom 0.203: RN3.4 34.03,9.27 J3.16
P1.2
  Top 0.203: IC1.30 46.22,31.97 47.69,30.51 47.69,20.39 J3.11
  Bottom 0.203: RN3.5 34.37,3.96 34.64,3.96 39.78,9.09 39.78,11.54 41.06,12.82 J3.11
P1.3
  Top 0.203: IC1.31 46.46,32.37 48.2,30.63 48.2,20.14 42.27,14.21 42.27,12.68 41.06,11.48 J3.12
  Bottom 0.203: RN3.6 33.4,3.37 33.4,3.14 33.58,2.96 34.47,2.96 40.9,9.39 40.9,11.06 J3.12
P1.4  (via drill 0.35)
  Top 0.203: IC1.32 47.05,32.77 v47.8,32.03 | v44.49,57.45 41.42,57.45 D2.2 40.98,57.89 40.62,57.89 38.74,59.77 H1.1 | v47.95,53.49 47.34,54.1 | 47.34,54.1 46.93,54.51 v46.93,54.56 | R5.1 41.47,54.1 47.34,54.1
  Bottom 0.203: v47.8,32.03 48.1,32.33 48.1,53.34 v47.95,53.49 | v46.93,54.56 44.49,57 v44.49,57.45
P1.5  (via drill 0.35)
  Top 0.203: IC1.33 47.66,33.17 49.19,31.65 v49.34,31.65 | v48.18,56.34 37.27,56.34 H2.1
  Top 0.305: D3.1 50.94,59.15 48.46,56.67 48.18,56.39 v48.18,56.34
  Bottom 0.305: v49.34,31.65 49.34,55.17 v48.18,56.34
P1.6  (via drill 0.35)
  Top 0.203: IC1.34 48.46,33.57 50.03,32 50.03,30.43 v49.98,30.38 | v69.3,38.24 69.3,59.83 67.33,61.8 BT_SLAVE.34
  Top 0.254: v49.98,30.38 49.98,20.6 43.6,14.22 J3.9
  Bottom 0.203: v49.98,30.38 51.21,31.61 51.21,33.33 51.39,33.51 57.25,33.51 61.98,38.24 v69.3,38.24 | RN3.7 32.6,3.37 32.6,3.14 33.24,2.51 34.95,2.51 42.19,9.75 42.19,11.85 43.6,13.26 J3.9
P1.7
  Top 0.203: IC1.35 49.18,33.97 50.74,32.41 50.74,20.14 44.94,14.34 44.94,12.56 J3.10
  Bottom 0.203: J3.10 42.8,10.42 42.8,9.23 35.47,1.9 33.05,1.9 31.8,3.14 31.8,3.3 RN3.8
P2.0
  Top 0.203: IC1.37 48.41,34.77 49.22,35.59 50.74,35.59 51.5,34.82 51.5,19.12 J3.7
  Bottom 0.203: RN4.1 46.22,9.55 45.01,10.76 45.01,11.69 46.14,12.82 J3.7
P2.1
  Top 0.203: IC1.38 47.92,35.17 49.09,36.35 51.38,36.35 52.14,35.59 52.14,18.06 49.05,14.97 48.11,14.97 47.35,14.21 47.35,12.43 J3.8
  Bottom 0.203: RN4.2 47.09,10.28 J3.8
P2.2
  Top 0.203: IC1.39 47.43,35.57 48.84,36.98 51.63,36.98 52.9,35.71 52.9,17.98 J3.5
  Bottom 0.203: RN4.3 47.89,10.42 47.55,10.76 47.55,12.63 J3.5
P2.3
  Top 0.203: IC1.40 46.69,35.97 48.58,37.87 51.76,37.87 53.66,35.97 53.66,17.86 49.89,14.08 49.89,12.43 J3.6
  Bottom 0.203: RN4.4 48.76,11.15 J3.6
P2.4
  Top 0.203: IC1.41 46.07,36.37 48.33,38.63 52.52,38.63 54.3,36.86 54.3,17.19 51.22,14.12 J3.3
  Bottom 0.203: J3.3 49.81,12.35 49.81,4.77 49.07,4.02 RN4.5
P2.5
  Top 0.203: IC1.42 45.42,37.03 47.82,39.43 53.25,39.43 55.11,37.57 55.11,16.08 54,14.97 52.83,14.97 52.43,14.57 52.43,12.68 51.22,11.48 J3.4
  Bottom 0.203: J3.4 51.22,4.57 49.16,2.51 48.52,2.51 47.88,3.14 RN4.6
P2.6
  Top 0.203: IC1.43 46.98,40.03 53.54,40.03 55.77,37.8 55.77,15.34 54.19,13.76 J3.1
  Bottom 0.203: RN4.7 47.09,2.64 47.97,1.75 49.59,1.75 52.63,4.8 52.63,11.69 53.76,12.82 J3.1
P2.7
  Top 0.203: IC1.44 44.17,38.54 46.3,40.67 54.17,40.67 56.51,38.33 56.51,13.97 J3.2
  Bottom 0.203: RN4.8 46.22,2.03 47.39,0.86 49.67,0.86 53.76,4.95 J3.2
P3.0  (via drill 0.35)
  Top 0.203: v41.17,49.12 41.22,49.12 42.97,47.37 IC1.47 | v9.62,44.6 4.54,39.52 4.54,18.28 11.6,11.22 J3.34
  Bottom 0.203: v41.17,49.12 14.14,49.12 v9.62,44.6 | RN1.1 8.6,8.26 11.57,11.23 J3.34
P3.1  (via drill 0.35)
  Top 0.203: IC1.48 42.57,46.46 v40.96,48.06 | v10.48,43.84 5.4,38.76 5.4,18.94 10.58,13.76 J3.33
  Bottom 0.203: v40.96,48.06 14.7,48.06 v10.48,43.84 | RN1.2 9.47,5.98 14.25,10.76 14.25,11.69 13.12,12.82 J3.33
P3.2  (via drill 0.35)
  Top 0.203: IC1.49 42.17,45.71 v40.82,47.05 | v11.24,43.21 6.16,38.13 6.16,19.69 10.97,14.89 13.59,14.89 14.25,14.23 14.25,12.63 J3.32
  Bottom 0.203: v40.82,47.05 15.09,47.05 v11.24,43.21 | RN1.3 10.52,5.47 10.52,5.7 15.66,10.84 J3.32
P3.3  (via drill 0.35)
  Top 0.203: IC1.50 41.77,44.91 v40.56,46.13 | v12.01,42.57 6.93,37.49 6.93,20.57 11.88,15.62 14.11,15.62 15.66,14.07 J3.31
  Bottom 0.203: v40.56,46.13 15.56,46.13 v12.01,42.57 | J3.31 15.66,12.82 16.79,11.69 16.79,10.76 16.13,10.09 16.02,10.09 RN1.4
P3.4  (via drill 0.35)
  Top 0.203: IC1.51 41.37,44.1 v40.3,45.17 | v12.77,41.94 7.69,36.86 7.69,21.38 12.73,16.33 14.69,16.33 16.79,14.23 16.79,12.63 J3.30
  Bottom 0.203: v40.3,45.17 16,45.17 v12.77,41.94 | RN1.5 18.2,10.88 J3.30
P3.5  (via drill 0.35)
  Top 0.203: IC1.52 40.97,43.21 v39.97,44.21 | v13.41,41.29 8.33,36.21 8.33,22.22 13.26,17.3 14.67,17.3 J3.29
  Bottom 0.203: v39.97,44.21 16.33,44.21 v13.41,41.29 | RN1.6 10.52,3.58 10.52,3.35 10.7,3.17 11.74,3.17 19.33,10.76 19.33,11.69 18.2,12.82 J3.29
P3.6  (via drill 0.35)
  Top 0.203: IC1.53 40.57,42.3 39.63,43.25 v39.58,43.25 | v14.04,40.64 8.96,35.56 8.96,22.7 13.65,18.01 15.56,18.01 19.33,14.23 19.33,12.63 J3.28
  Bottom 0.203: v39.58,43.25 16.65,43.25 v14.04,40.64 | RN1.7 9.72,3.58 9.72,3.35 10.3,2.76 12.28,2.76 J3.28
P3.7  (via drill 0.35)
  Top 0.203: IC1.54 40.17,41.37 v39.28,42.26 | v14.8,39.78 9.72,34.7 9.72,23.28 14.28,18.72 16.24,18.72 20.74,14.22 J3.27
  Bottom 0.203: v39.28,42.26 17.28,42.26 v14.8,39.78 | RN1.8 8.92,3.51 8.92,3.35 9.91,2.35 13.47,2.35 21.87,10.76 21.87,11.69 20.74,12.82 J3.27
P4.0
  Top 0.203: J3.26 21.87,12.63 21.87,14.23 16.52,19.58 14.52,19.58 10.6,23.51 10.6,29.6 12.64,31.65 32.73,31.65 36.26,35.17 IC1.5
  Bottom 0.203: RN2.1 20.16,8.1 J3.26
P4.1
  Top 0.203: J3.25 16.62,20.42 15.1,20.42 11.63,23.9 11.63,29.11 13.66,31.14 32.83,31.14 36.47,34.77 IC1.6
  Bottom 0.203: RN2.2 21.03,7.37 24.41,10.76 24.41,11.69 23.28,12.82 J3.25
P5.0
  Top 0.203: J3.24 24.41,12.63 24.41,14.23 17.36,21.29 15.42,21.29 12.51,24.19 12.51,28.6 14.42,30.51 32.96,30.51 36.83,34.37 IC1.7
  Bottom 0.203: RN2.3 22.08,5.21 22.08,5.44 25.82,9.19 J3.24
P5.1
  Top 0.203: J3.23 17.21,22.38 15.44,22.38 13.66,24.16 13.66,28.22 15.28,29.85 32.87,29.85 37,33.97 IC1.8
  Bottom 0.203: J3.23 25.82,12.82 26.95,11.69 26.95,9.22 RN2.4
P6.0
  Top 0.203: C21.2 31.62,37.41 Y1.1 34.66,36.38 34.74,36.38 34.75,36.37 IC1.2
P6.1
  Top 0.203: C50.2 Y1.2 34.69,35.97 IC1.3
VCCD
  Top 0.203: IC1.56 36.92,40.07
  Top 0.254: 36.92,40.07 C20.1
VDDA  (via drill 0.35)
  Top 0.203: IC1.46 43.37,41.04 v43.76,41.43 | FB2.2 61.28,22.76 v61.28,21.23 | v50.36,34.19 50.17,34.37 IC1.36
  Top 0.254: v50.23,41.43 v43.76,41.43
  Top 0.381: H5.1 63,24.47 FB2.2
  Bottom 0.203: C17.1 C16.1 53.13,34.19 v50.36,34.19 50.34,34.19 50.34,31.67 46.88,28.22 42.48,28.22 41.98,27.72 41.98,27.2 42.61,26.57 48.07,26.57 50.63,29.13 68.66,29.13 69.18,28.61 69.18,27.78 68.35,26.95 67,26.95 v61.28,21.23 | v43.76,41.43 43.76,43.44 C19.1 42.29,43.65 41.72,44.22 41.72,46.63 42.23,47.14 43.82,47.14 C18.1
  Bottom 0.254: v50.36,34.19 50.36,41.3 v50.23,41.43
VDDD  (via drill 0.35)
  Top 0.203: C10.1 27.93,41.67 v27.93,41.3 | C13.1 53.54,45.68 BT_SLAVE.12 | v42.97,27.38 42.57,27.78 IC1.23 42.56,34.7 40.48,36.77 IC1.1 | 57.19,30.25 v57.16,30.23 | J2.4 14.67,66.04 v17.98,66.04 | v17.98,57.66 18.96,57.66 C22.1 | J1.1 27.49,63.54 v27.58,63.45 | v25.9,54.91 25.2,54.91 C23.1
  Top 0.254: 57.6,31.52 57.6,38.16 54.58,41.17 51.63,41.17 50.36,42.44 50.36,44.28 C13.1 | v50.87,52.35 51.63,51.59 C14.1 50.74,50.51 50.16,49.92 50.16,46.77 51.25,45.68 | v49.09,60.99 44.98,60.99 44.83,60.84 44.63,60.84
  Top 0.381: R4.2 44.63,60.84
  Bottom 0.203: v49.09,60.99 44.04,66.04 v17.98,66.04 v17.98,57.66 | v27.93,41.3 27.93,38.41 R3.2 | v42.97,27.38 47.45,27.38 49.7,29.64 51.1,29.64 52.11,30.66 C11.1 C12.1 55.32,30.23 v57.16,30.23 | v27.58,63.45 27.58,56.59 v25.9,54.91
  Bottom 0.254: v50.87,52.35 50.87,59.21 v49.09,60.99
  pour Top: 75.99,62.43 -1.23,62.43 -1.23,15.52 -0.79,15.95 75.28,15.95 75.28,61.67 75.99,62.38
VDDR  (via drill 0.35)
  Top 0.203: FB1.2 67.09,27.04 v68.39,28.35 | v36.97,31.72 36.87,31.83 36.87,32.11 37.94,33.17 IC1.10 | IC1.15 38.52,29.87 v38.3,29.87 | IC1.18 40.57,28.82 v39.97,28.22 | C1.1 32.03,20.65 30.02,22.66 30.02,25.27 30.4,25.65 32.32,25.65 C2.1 37.3,30.63 v37.53,30.63 37.58,30.63 IC1.14
  Top 0.381: H6.1 67.12,24.49 FB1.2
  Bottom 0.203: v68.39,28.35 54.47,28.35 C8.1 52.65,26.52 C7.1 49.77,26.02 42.17,26.02 v39.97,28.22 38.32,29.87 v38.3,29.87 v37.53,30.63 36.97,31.19 v36.97,31.72
  Bottom 0.254: C6.1 23.68,29.37 23.69,29.36 37.79,29.36 v38.3,29.87 | C5.1 C6.1 | C6.1 22.91,29.35 C3.1 27.71,26.92 C4.1
VREF  (via drill 0.35)
  Top 0.203: IC1.45 43.77,39.58 v44.2,40.01
  Bottom 0.203: v44.2,40.01 44.2,40.04 45.83,41.66 45.83,43.44 C15.1
XTAL24I  (via drill 0.35)
  Top 0.203: v37.91,28.22 37.91,28.34 39.77,30.2 IC1.16
  Bottom 0.203: v37.91,28.22 35.69,26 Y2.1
XTAL24O  (via drill 0.35)
  Top 0.203: v38.93,27.46 38.95,27.48 38.95,28.35 40.17,29.57 IC1.17
  Bottom 0.203: Y2.3 37.5,23.35 38,23.35 38.93,24.28 v38.93,27.46

### Text on the board
tPlace: MINIPROG3 | GND | P1.5 | P1.4 | SWD | ROBOTAR MCU board / Zhewen Pan / REV 1.0 / Oct 3rd | RESET | VDDD | VDDA | VDDR | GND | 3V3 | GPIO Breakout